# EAGLE schematic Schematic (EAGLE 9.7.0)
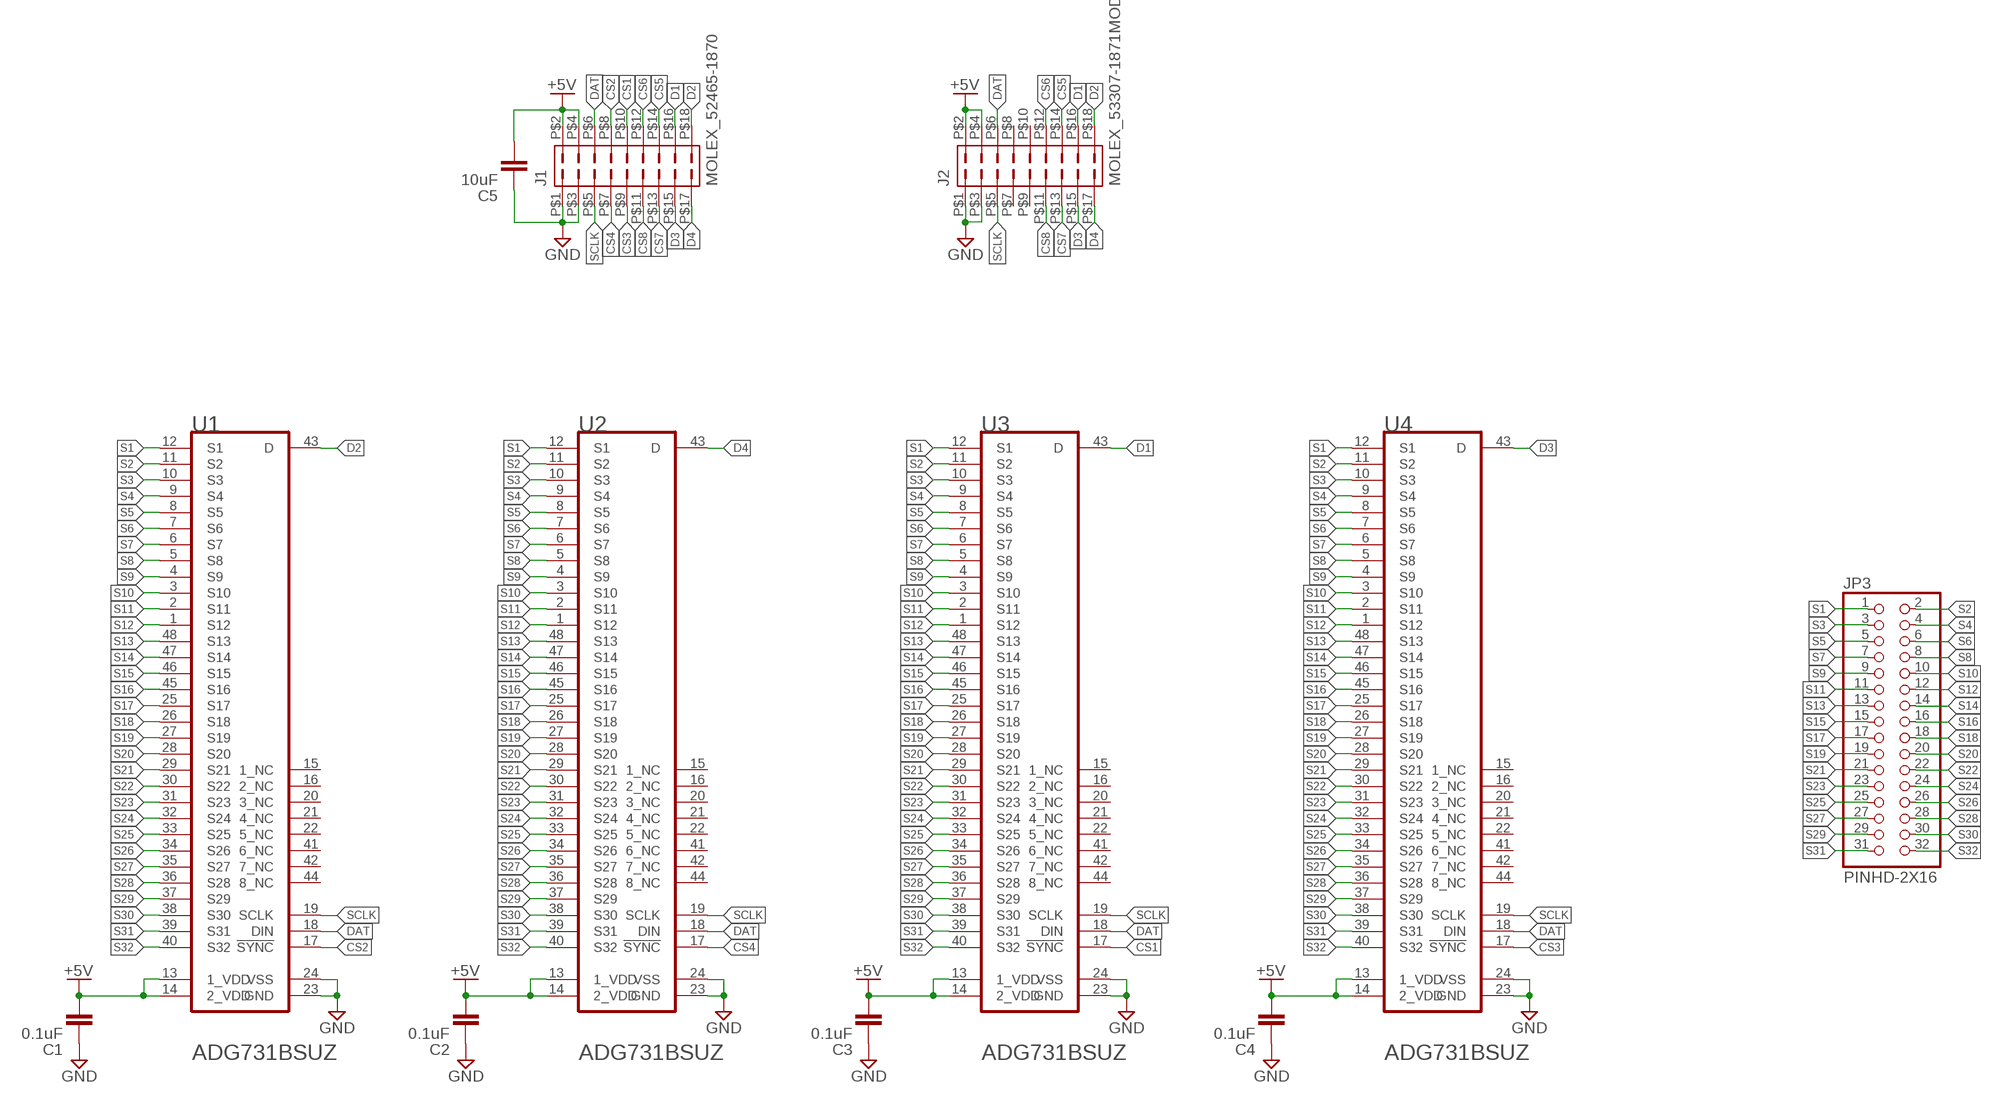
[diagram p0: schematic, sheet 1]

## Parts
C1  0.1uF  C_CHIP-0603(1608-METRIC)  [CAPC1608X85]
C2  0.1uF  C_CHIP-0603(1608-METRIC)  [CAPC1608X85]
C3  0.1uF  C_CHIP-0603(1608-METRIC)  [CAPC1608X85]
C4  0.1uF  C_CHIP-0603(1608-METRIC)  [CAPC1608X85]
C5  10uF  C_CHIP-0805(2012-METRIC)  [CAPC2012X110]
J1  MOLEX_52465-1870  [MOLEX_52465-1870]
J2  MOLEX_53307-1871MOD  [MOLEX_53307-1871_MOD]
JP3  PINHD-2X16  [2X16]
U1  ANALOG_DEVICES_ADG731BSUZANALOG_DEVICES_ADG731BSUZ_0_0  [ANALOG_DEVICES_ADG731BSUZ_0]
U2  ANALOG_DEVICES_ADG731BSUZANALOG_DEVICES_ADG731BSUZ_0_0  [ANALOG_DEVICES_ADG731BSUZ_0]
U3  ANALOG_DEVICES_ADG731BSUZANALOG_DEVICES_ADG731BSUZ_0_0  [ANALOG_DEVICES_ADG731BSUZ_0]
U4  ANALOG_DEVICES_ADG731BSUZANALOG_DEVICES_ADG731BSUZ_0_0  [ANALOG_DEVICES_ADG731BSUZ_0]

## Nets
+5V: C1.2 C2.2 C3.2 C4.2 C5.2 J1.P$2 J1.P$4 J2.P$2 J2.P$4 U1.13(1_VDD) U1.14(2_VDD) U2.13(1_VDD) U2.14(2_VDD) U3.13(1_VDD) U3.14(2_VDD) U4.13(1_VDD) U4.14(2_VDD)
CS1: J1.P$10 U3.17(!SYNC!)
CS2: J1.P$8 U1.17(!SYNC!)
CS3: J1.P$9 U4.17(!SYNC!)
CS4: J1.P$7 U2.17(!SYNC!)
CS5: J1.P$14 J2.P$14
CS6: J1.P$12 J2.P$12
CS7: J1.P$13 J2.P$13
CS8: J1.P$11 J2.P$11
D1: J1.P$16 J2.P$16 U3.43(D)
D2: J1.P$18 J2.P$18 U1.43(D)
D3: J1.P$15 J2.P$15 U4.43(D)
D4: J1.P$17 J2.P$17 U2.43(D)
DAT: J1.P$6 J2.P$6 U1.18(DIN) U2.18(DIN) U3.18(DIN) U4.18(DIN)
GND: C1.1 C2.1 C3.1 C4.1 C5.1 J1.P$1 J1.P$3 J2.P$1 J2.P$3 U1.23(GND) U1.24(VSS) U2.23(GND) U2.24(VSS) U3.23(GND) U3.24(VSS) U4.23(GND) U4.24(VSS)
S1: JP3.1 U1.12(S1) U2.12(S1) U3.12(S1) U4.12(S1)
S2: JP3.2 U1.11(S2) U2.11(S2) U3.11(S2) U4.11(S2)
S3: JP3.3 U1.10(S3) U2.10(S3) U3.10(S3) U4.10(S3)
S4: JP3.4 U1.9(S4) U2.9(S4) U3.9(S4) U4.9(S4)
S5: JP3.5 U1.8(S5) U2.8(S5) U3.8(S5) U4.8(S5)
S6: JP3.6 U1.7(S6) U2.7(S6) U3.7(S6) U4.7(S6)
S7: JP3.7 U1.6(S7) U2.6(S7) U3.6(S7) U4.6(S7)
S8: JP3.8 U1.5(S8) U2.5(S8) U3.5(S8) U4.5(S8)
S9: JP3.9 U1.4(S9) U2.4(S9) U3.4(S9) U4.4(S9)
S10: JP3.10 U1.3(S10) U2.3(S10) U3.3(S10) U4.3(S10)
S11: JP3.11 U1.2(S11) U2.2(S11) U3.2(S11) U4.2(S11)
S12: JP3.12 U1.1(S12) U2.1(S12) U3.1(S12) U4.1(S12)
S13: JP3.13 U1.48(S13) U2.48(S13) U3.48(S13) U4.48(S13)
S14: JP3.14 U1.47(S14) U2.47(S14) U3.47(S14) U4.47(S14)
S15: JP3.15 U1.46(S15) U2.46(S15) U3.46(S15) U4.46(S15)
S16: JP3.16 U1.45(S16) U2.45(S16) U3.45(S16) U4.45(S16)
S17: JP3.17 U1.25(S17) U2.25(S17) U3.25(S17) U4.25(S17)
S18: JP3.18 U1.26(S18) U2.26(S18) U3.26(S18) U4.26(S18)
S19: JP3.19 U1.27(S19) U2.27(S19) U3.27(S19) U4.27(S19)
S20: JP3.20 U1.28(S20) U2.28(S20) U3.28(S20) U4.28(S20)
S21: JP3.21 U1.29(S21) U2.29(S21) U3.29(S21) U4.29(S21)
S22: JP3.22 U1.30(S22) U2.30(S22) U3.30(S22) U4.30(S22)
S23: JP3.23 U1.31(S23) U2.31(S23) U3.31(S23) U4.31(S23)
S24: JP3.24 U1.32(S24) U2.32(S24) U3.32(S24) U4.32(S24)
S25: JP3.25 U1.33(S25) U2.33(S25) U3.33(S25) U4.33(S25)
S26: JP3.26 U1.34(S26) U2.34(S26) U3.34(S26) U4.34(S26)
S27: JP3.27 U1.35(S27) U2.35(S27) U3.35(S27) U4.35(S27)
S28: JP3.28 U1.36(S28) U2.36(S28) U3.36(S28) U4.36(S28)
S29: JP3.29 U1.37(S29) U2.37(S29) U3.37(S29) U4.37(S29)
S30: JP3.30 U1.38(S30) U2.38(S30) U3.38(S30) U4.38(S30)
S31: JP3.31 U1.39(S31) U2.39(S31) U3.39(S31) U4.39(S31)
S32: JP3.32 U1.40(S32) U2.40(S32) U3.40(S32) U4.40(S32)
SCLK: J1.P$5 J2.P$5 U1.19(SCLK) U2.19(SCLK) U3.19(SCLK) U4.19(SCLK)
Unconnected: J2.P$7 J2.P$8 J2.P$9 J2.P$10 U1.15(1_NC) U1.16(2_NC) U1.20(3_NC) U1.21(4_NC) U1.22(5_NC) U1.41(6_NC) U1.42(7_NC) U1.44(8_NC) U2.15(1_NC) U2.16(2_NC) U2.20(3_NC) U2.21(4_NC) U2.22(5_NC) U2.41(6_NC) U2.42(7_NC) U2.44(8_NC) U3.15(1_NC) U3.16(2_NC) U3.20(3_NC) U3.21(4_NC) U3.22(5_NC) U3.41(6_NC) U3.42(7_NC) U3.44(8_NC) U4.15(1_NC) U4.16(2_NC) U4.20(3_NC) U4.21(4_NC) U4.22(5_NC) U4.41(6_NC) U4.42(7_NC) U4.44(8_NC)

## Library data of the parts
C1-C5 = Capacitor:C: Capacitor - Generic; CATEGORY: Capacitor
J1 = Molex 52465-1870:MOLEX_52465-1870
J2 = Molex 53307-1871:MOLEX_53307-1871
JP3 = Connector:PINHD-2X16: PIN HEADER
U1-U4 = Analog Devices - ADG731BSUZ:ANALOG_DEVICES_ADG731BSUZ: ADI-ADG731-SU-48; BANDWIDTH_HZ: 18M; CIIVA_IDS: 19300650; CODE__JEDEC: MS-026ABC; COMPONENT_LINK_1_DESCRIPTION: Manufacturer URL; COMPONENT_LINK_1_URL: http://www.analog.com/en/index.html; COMPONENT_LINK_3_DESCRIPTION: Package Specification; COMPONENT_LINK_3_URL: http://www.analog.com/static/imported-files/packages/470644706845302410119987SU48_7x7.pdf; DATASHEET: http://www.analog.com/static/imported-files/data_sheets/ADG725_731.pdf; DATASHEET_VERSION: Rev. A; FOOTPRINT_VARIANT_NAME_0: Level C; FOOTPRINT_VARIANT_NAME_1: Level B; FOOTPRINT_VARIANT_NAME_2: Level A; IMPORTED: yes; IMPORTED_FROM: vault; IMPORT_TS: 1521857462; MAX_ANALOG_SIGNAL_RANGE: Vss to Vdd; MF: Analog Devices; MOUNTING_TECHNOLOGY: Surface Mount; MPN: ADG731BSUZ; PACKAGE: SU-48; PACKAGE_DESCRIPTION: 48-Pin Thin Plastic Quad Flat Package, Body 7 x 7 mm, Pitch 0.5 mm; PACKING: Tray; PIN_0_0_39_INSIDE_EDGE: clock; PREFIX: U; RELEASE_DATE: 1391089390; RON_OHMS: 4; SUPPLY_V_GUAR_PERFORMANCE: Dual_(+/-2.5V), Single_(+3V), Single_(+5V); T_TRANSITION_S: 42n; VAULT_GUID: 76926279-8684-441A-80C4-6DFBDCC65274; VAULT_REVISION: 8C21F4D2-BBAB-4E50-B4EF-AC8EEE00B0BF